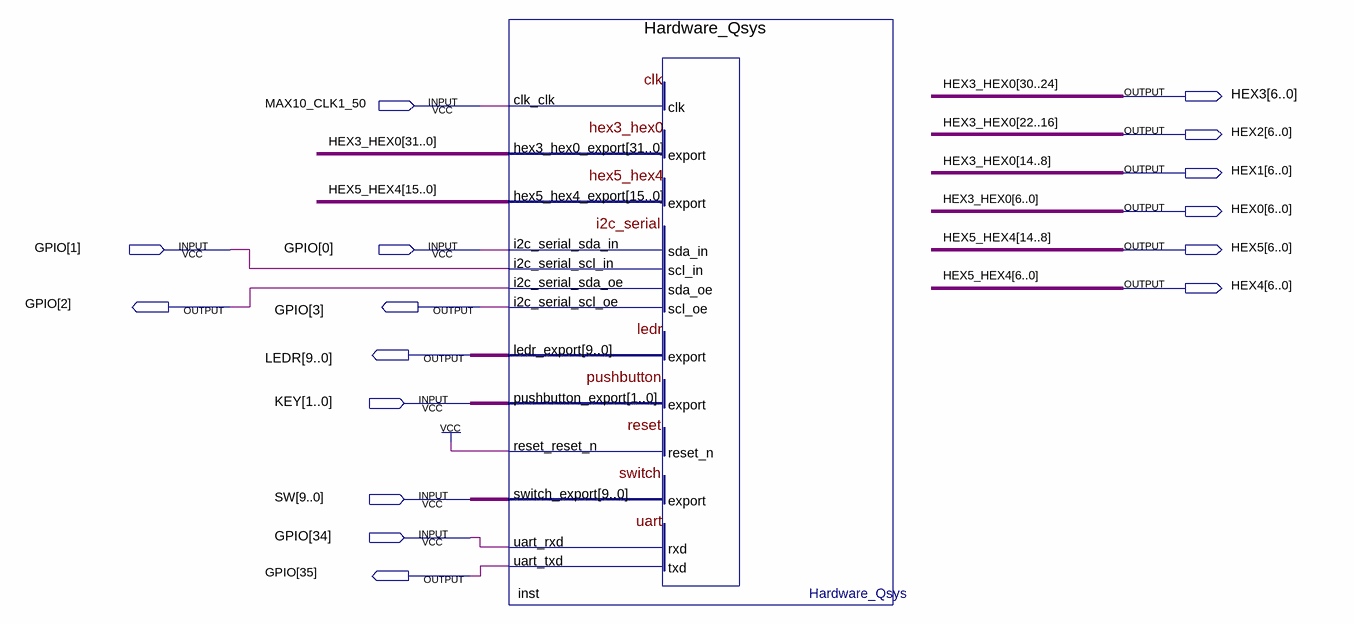
[diagram p0: schematic sheet]
// Quartus schematic Hardware_Mapper.bdf as structural Verilog: 1 symbols, 16 pins
module Hardware_Mapper (
  input  MAX10_CLK1_50,
  inout  [35:0] GPIO,
  input  [1:0] KEY,
  input  [9:0] SW,
  output [6:0] HEX3,
  output [6:0] HEX2,
  output [6:0] HEX1,
  output [6:0] HEX0,
  output [6:0] HEX5,
  output [6:0] HEX4,
  output [9:0] LEDR
);

  wire [15:7] HEX5_HEX4;
  wire [31:7] HEX3_HEX0;

  Hardware_Qsys inst (
    .clk_clk(MAX10_CLK1_50), .i2c_serial_sda_in(GPIO[0]), .i2c_serial_scl_in(GPIO[1]),
    .pushbutton_export(KEY), .reset_reset_n(1'b1), .switch_export(SW), .uart_rxd(GPIO[34]),
    .hex3_hex0_export({HEX3_HEX0[31], HEX3, HEX3_HEX0[23], HEX2, HEX3_HEX0[15], HEX1, HEX3_HEX0[7], HEX0}),
    .hex5_hex4_export({HEX5_HEX4[15], HEX5, HEX5_HEX4[7], HEX4}), .i2c_serial_sda_oe(GPIO[2]),
    .i2c_serial_scl_oe(GPIO[3]), .ledr_export(LEDR), .uart_txd(GPIO[35]));

  // Other names for the same wires on the sheet: HEX3_HEX0 (some bits) = {HEX3, HEX2, HEX1, HEX0};
  //   HEX5_HEX4 (some bits) = {HEX5, HEX4}
endmodule
